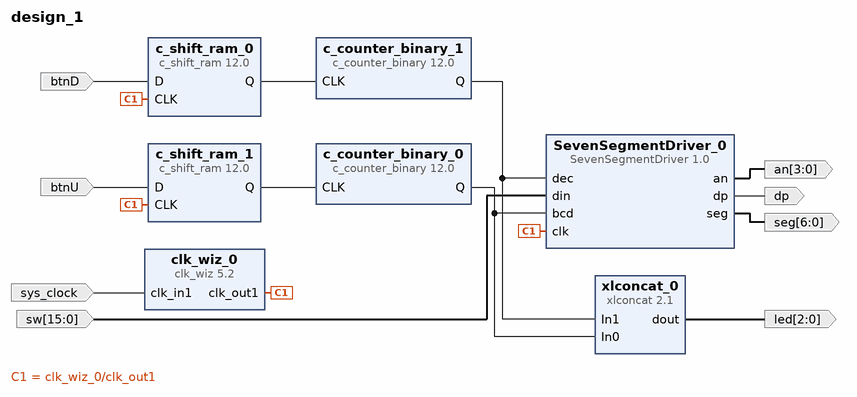
[diagram p0: block diagram of the top level]
# Vivado block design design_1, Vivado 2015.4
create_bd_design design_1

create_bd_port -dir I -type clk sys_clock
set_property -dict {CONFIG.FREQ_HZ 100000000 CONFIG.PHASE 0.000} [get_bd_ports sys_clock]
create_bd_port -dir O -from 3 -to 0 an
create_bd_port -dir O -from 6 -to 0 seg
create_bd_port -dir O dp
create_bd_port -dir I -from 15 -to 0 sw
create_bd_port -dir I btnU
create_bd_port -dir I btnD
create_bd_port -dir O -from 2 -to 0 led

create_bd_cell -type ip -vlnv usu.edu:ECE3700:SevenSegmentDriver:1.0 SevenSegmentDriver_0
create_bd_cell -type ip -vlnv xilinx.com:ip:clk_wiz:5.2 clk_wiz_0
set_property -dict [list \
  CONFIG.CLKOUT1_REQUESTED_OUT_FREQ 50.00 \
  CONFIG.USE_LOCKED false \
  CONFIG.USE_RESET false \
  CONFIG.MMCM_DIVCLK_DIVIDE 1 \
  CONFIG.MMCM_CLKOUT0_DIVIDE_F 20.000 \
  CONFIG.USE_BOARD_FLOW true \
  CONFIG.CLK_IN1_BOARD_INTERFACE sys_clock \
  CONFIG.CLKOUT1_JITTER 151.636 \
] [get_bd_cells clk_wiz_0]
create_bd_cell -type ip -vlnv xilinx.com:ip:c_counter_binary:12.0 c_counter_binary_0
set_property -dict {CONFIG.Output_Width 1} [get_bd_cells c_counter_binary_0]
create_bd_cell -type ip -vlnv xilinx.com:ip:c_counter_binary:12.0 c_counter_binary_1
set_property -dict {CONFIG.Output_Width 2} [get_bd_cells c_counter_binary_1]
create_bd_cell -type ip -vlnv xilinx.com:ip:c_shift_ram:12.0 c_shift_ram_0
set_property -dict {CONFIG.Width 1 CONFIG.Depth 1 CONFIG.DefaultData 0 CONFIG.AsyncInitVal 0} [get_bd_cells c_shift_ram_0]
create_bd_cell -type ip -vlnv xilinx.com:ip:xlconcat:2.1 xlconcat_0
set_property -dict {CONFIG.IN0_WIDTH 1 CONFIG.IN1_WIDTH 2} [get_bd_cells xlconcat_0]
create_bd_cell -type ip -vlnv xilinx.com:ip:c_shift_ram:12.0 c_shift_ram_1
set_property -dict {CONFIG.Width 1 CONFIG.Depth 1 CONFIG.DefaultData 0 CONFIG.AsyncInitVal 0} [get_bd_cells c_shift_ram_1]

# ---- connections ----

connect_bd_net [get_bd_ports sys_clock] [get_bd_pins clk_wiz_0/clk_in1]
connect_bd_net [get_bd_pins clk_wiz_0/clk_out1] [get_bd_pins SevenSegmentDriver_0/clk] [get_bd_pins c_shift_ram_0/CLK] [get_bd_pins c_shift_ram_1/CLK]
connect_bd_net [get_bd_pins SevenSegmentDriver_0/dp] [get_bd_ports dp]
connect_bd_net [get_bd_pins SevenSegmentDriver_0/an] [get_bd_ports an]
connect_bd_net [get_bd_pins SevenSegmentDriver_0/seg] [get_bd_ports seg]
connect_bd_net [get_bd_pins c_counter_binary_0/Q] [get_bd_pins SevenSegmentDriver_0/bcd] [get_bd_pins xlconcat_0/In0]
connect_bd_net [get_bd_pins c_counter_binary_1/Q] [get_bd_pins SevenSegmentDriver_0/dec] [get_bd_pins xlconcat_0/In1]
connect_bd_net [get_bd_ports sw] [get_bd_pins SevenSegmentDriver_0/din]
connect_bd_net [get_bd_pins xlconcat_0/dout] [get_bd_ports led]
connect_bd_net [get_bd_ports btnU] [get_bd_pins c_shift_ram_1/D]
connect_bd_net [get_bd_pins c_shift_ram_1/Q] [get_bd_pins c_counter_binary_0/CLK]
connect_bd_net [get_bd_ports btnD] [get_bd_pins c_shift_ram_0/D]
connect_bd_net [get_bd_pins c_shift_ram_0/Q] [get_bd_pins c_counter_binary_1/CLK]

validate_bd_design
save_bd_design
